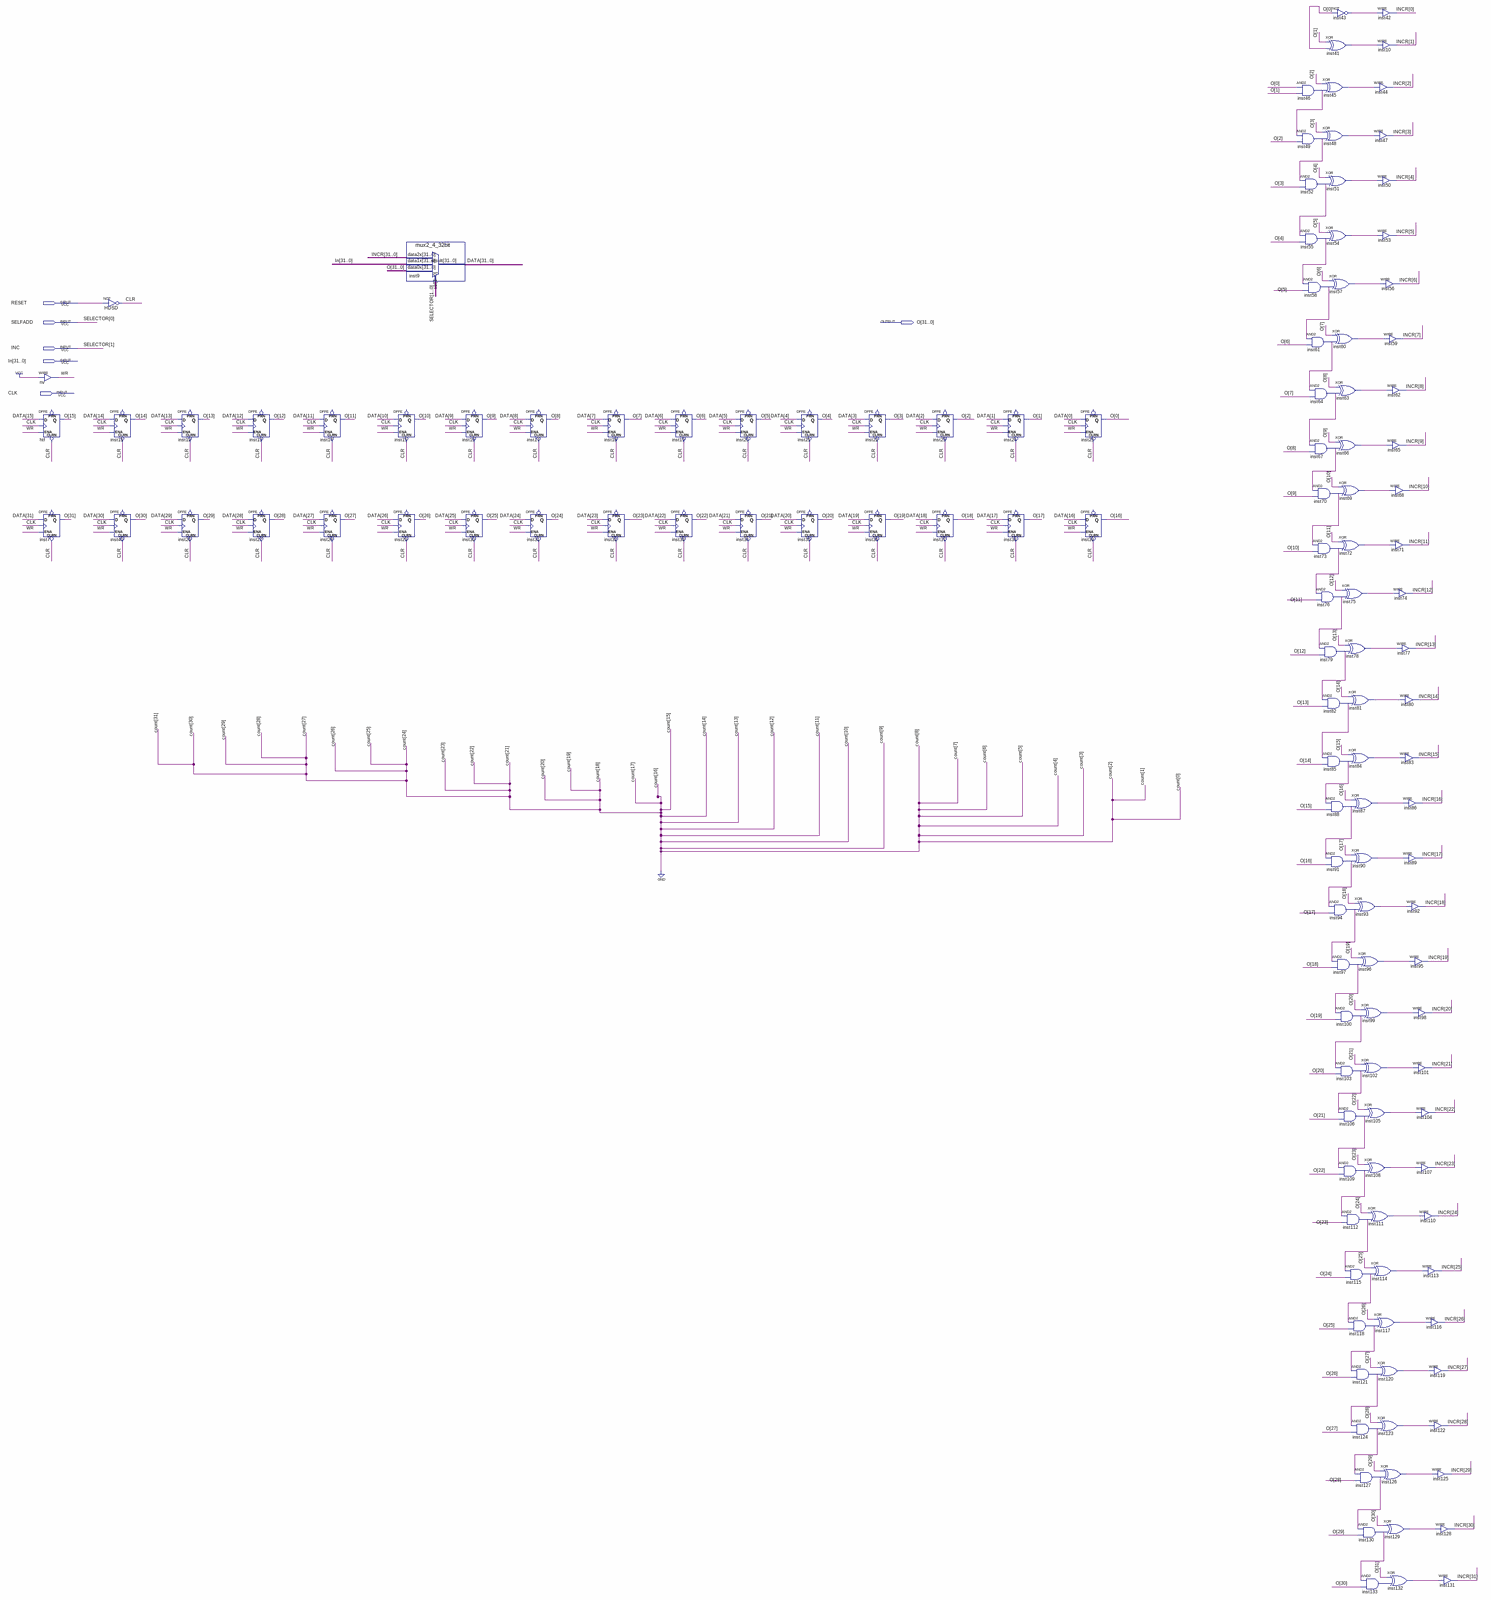
[diagram p0: schematic sheet, whole]
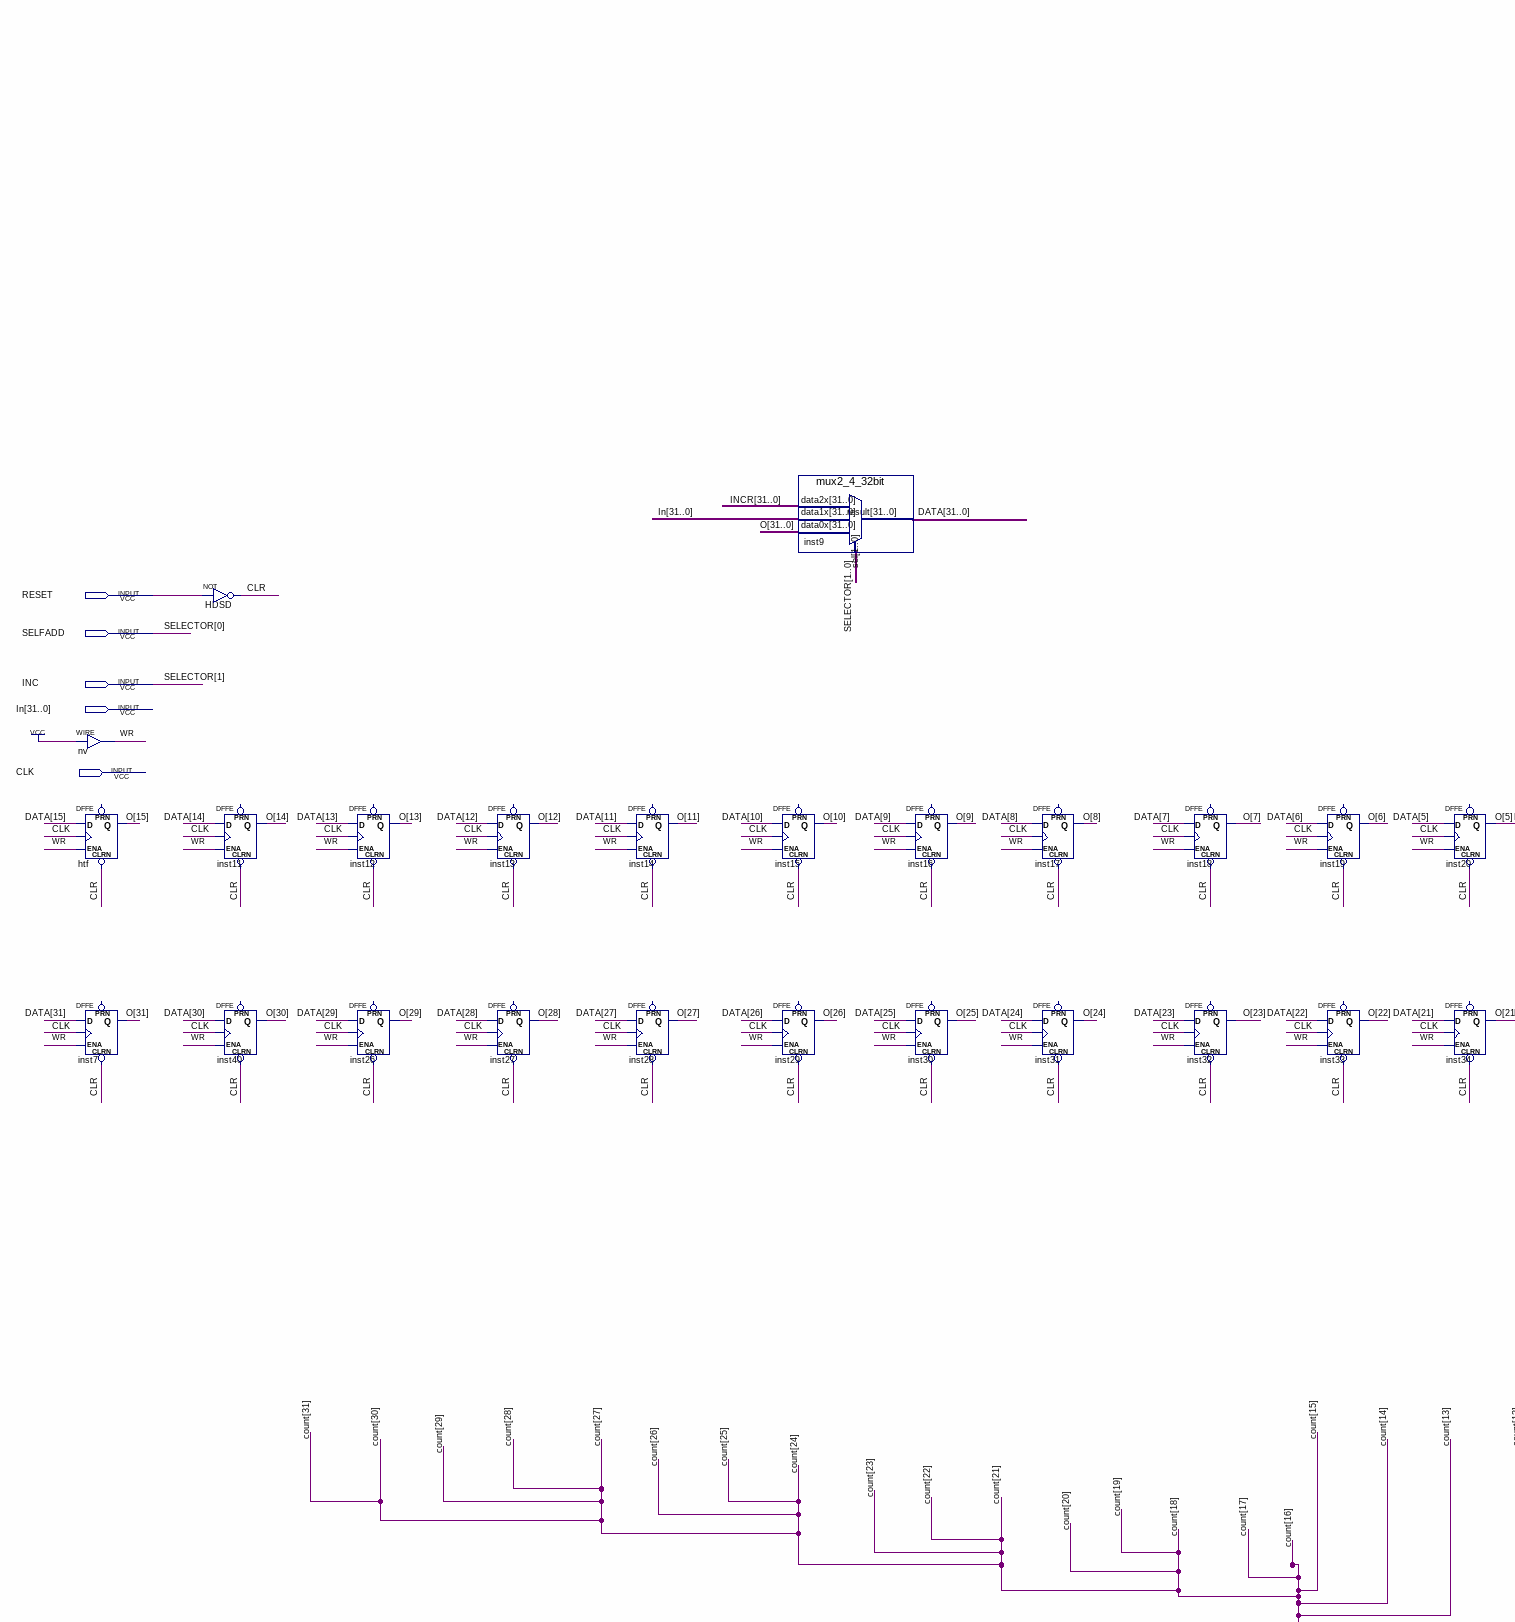
[diagram p1: schematic sheet, upper left part]
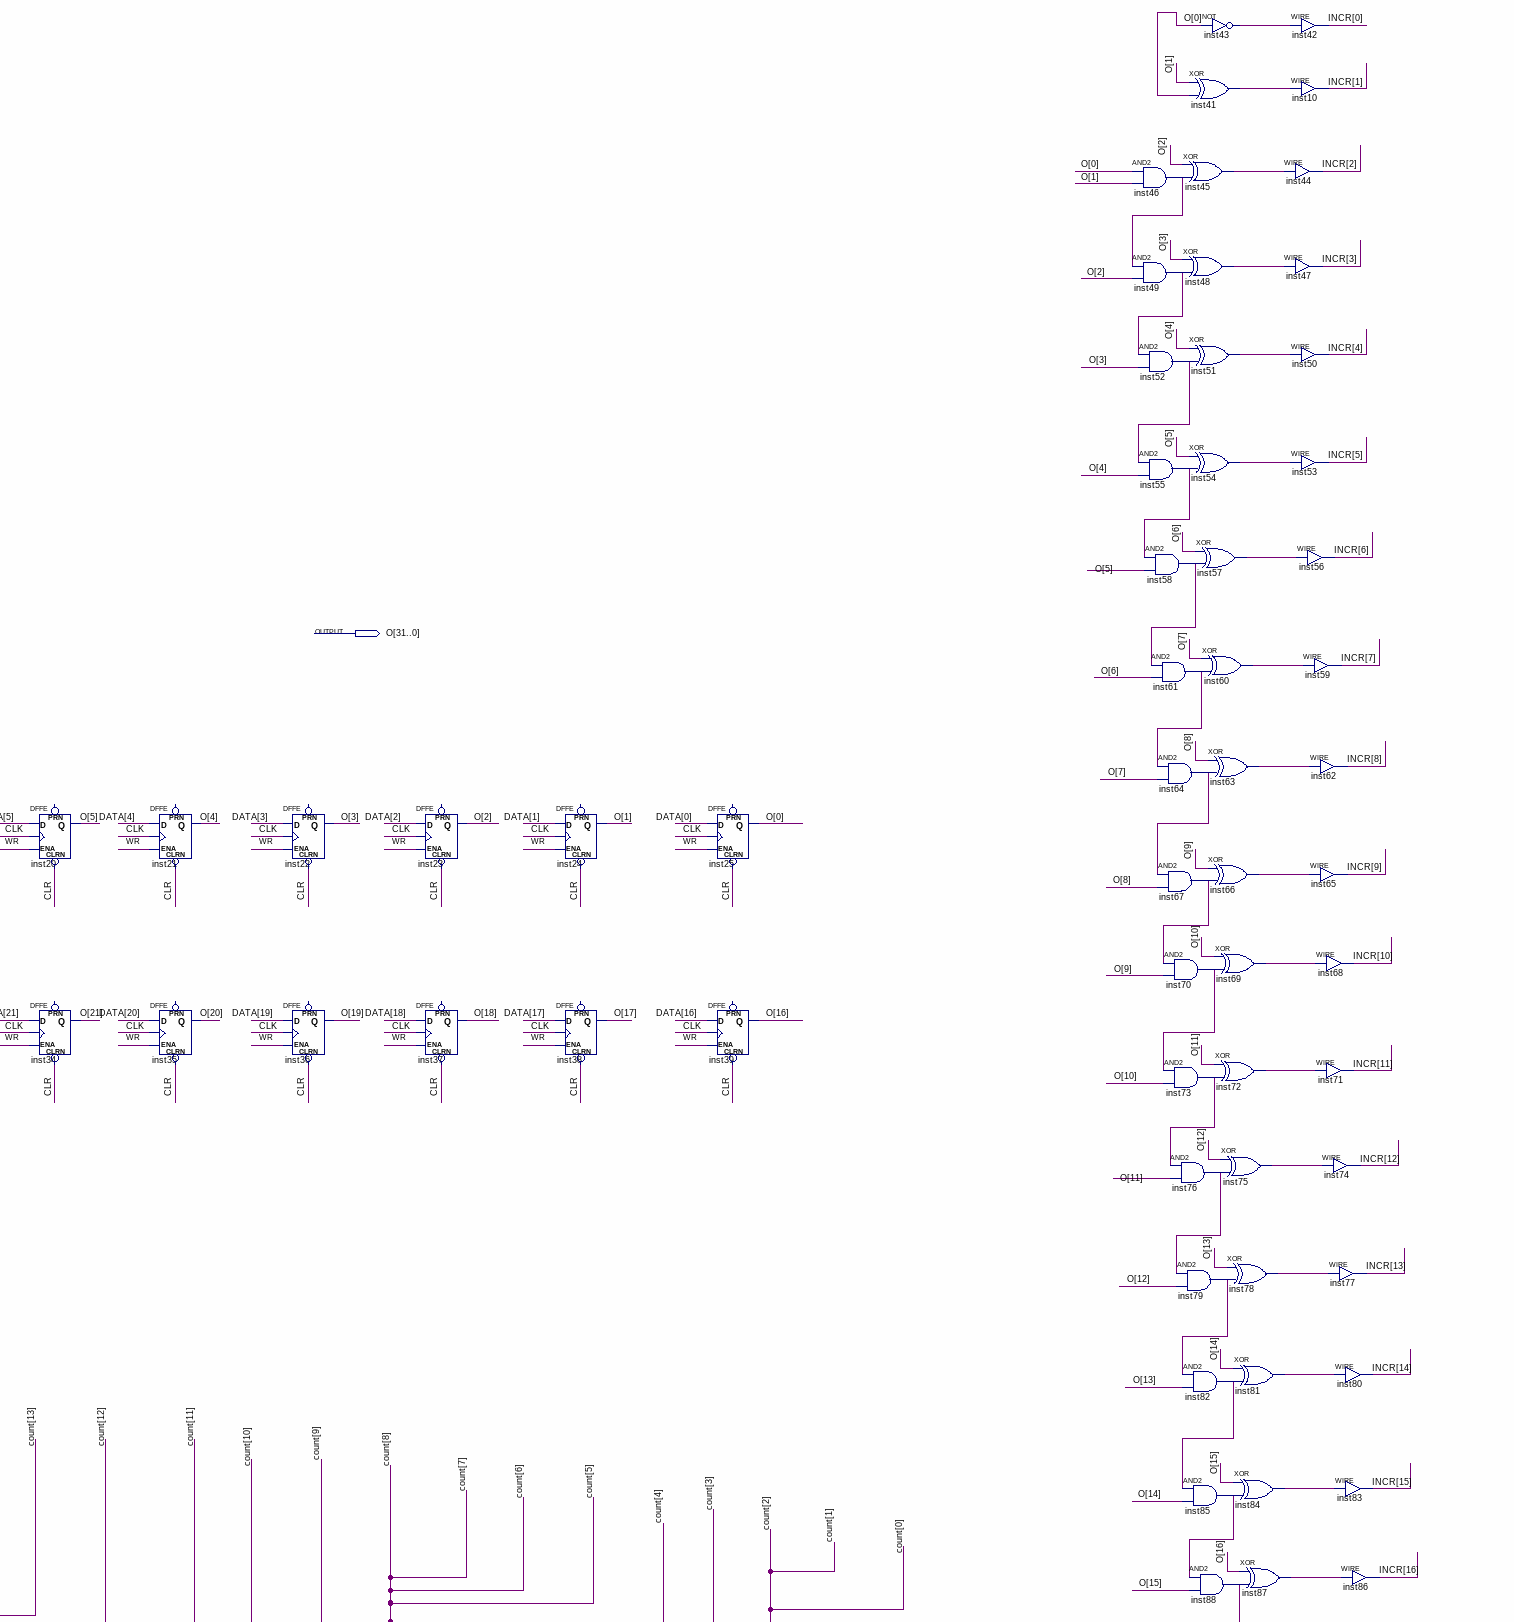
[diagram p2: schematic sheet, upper right part]
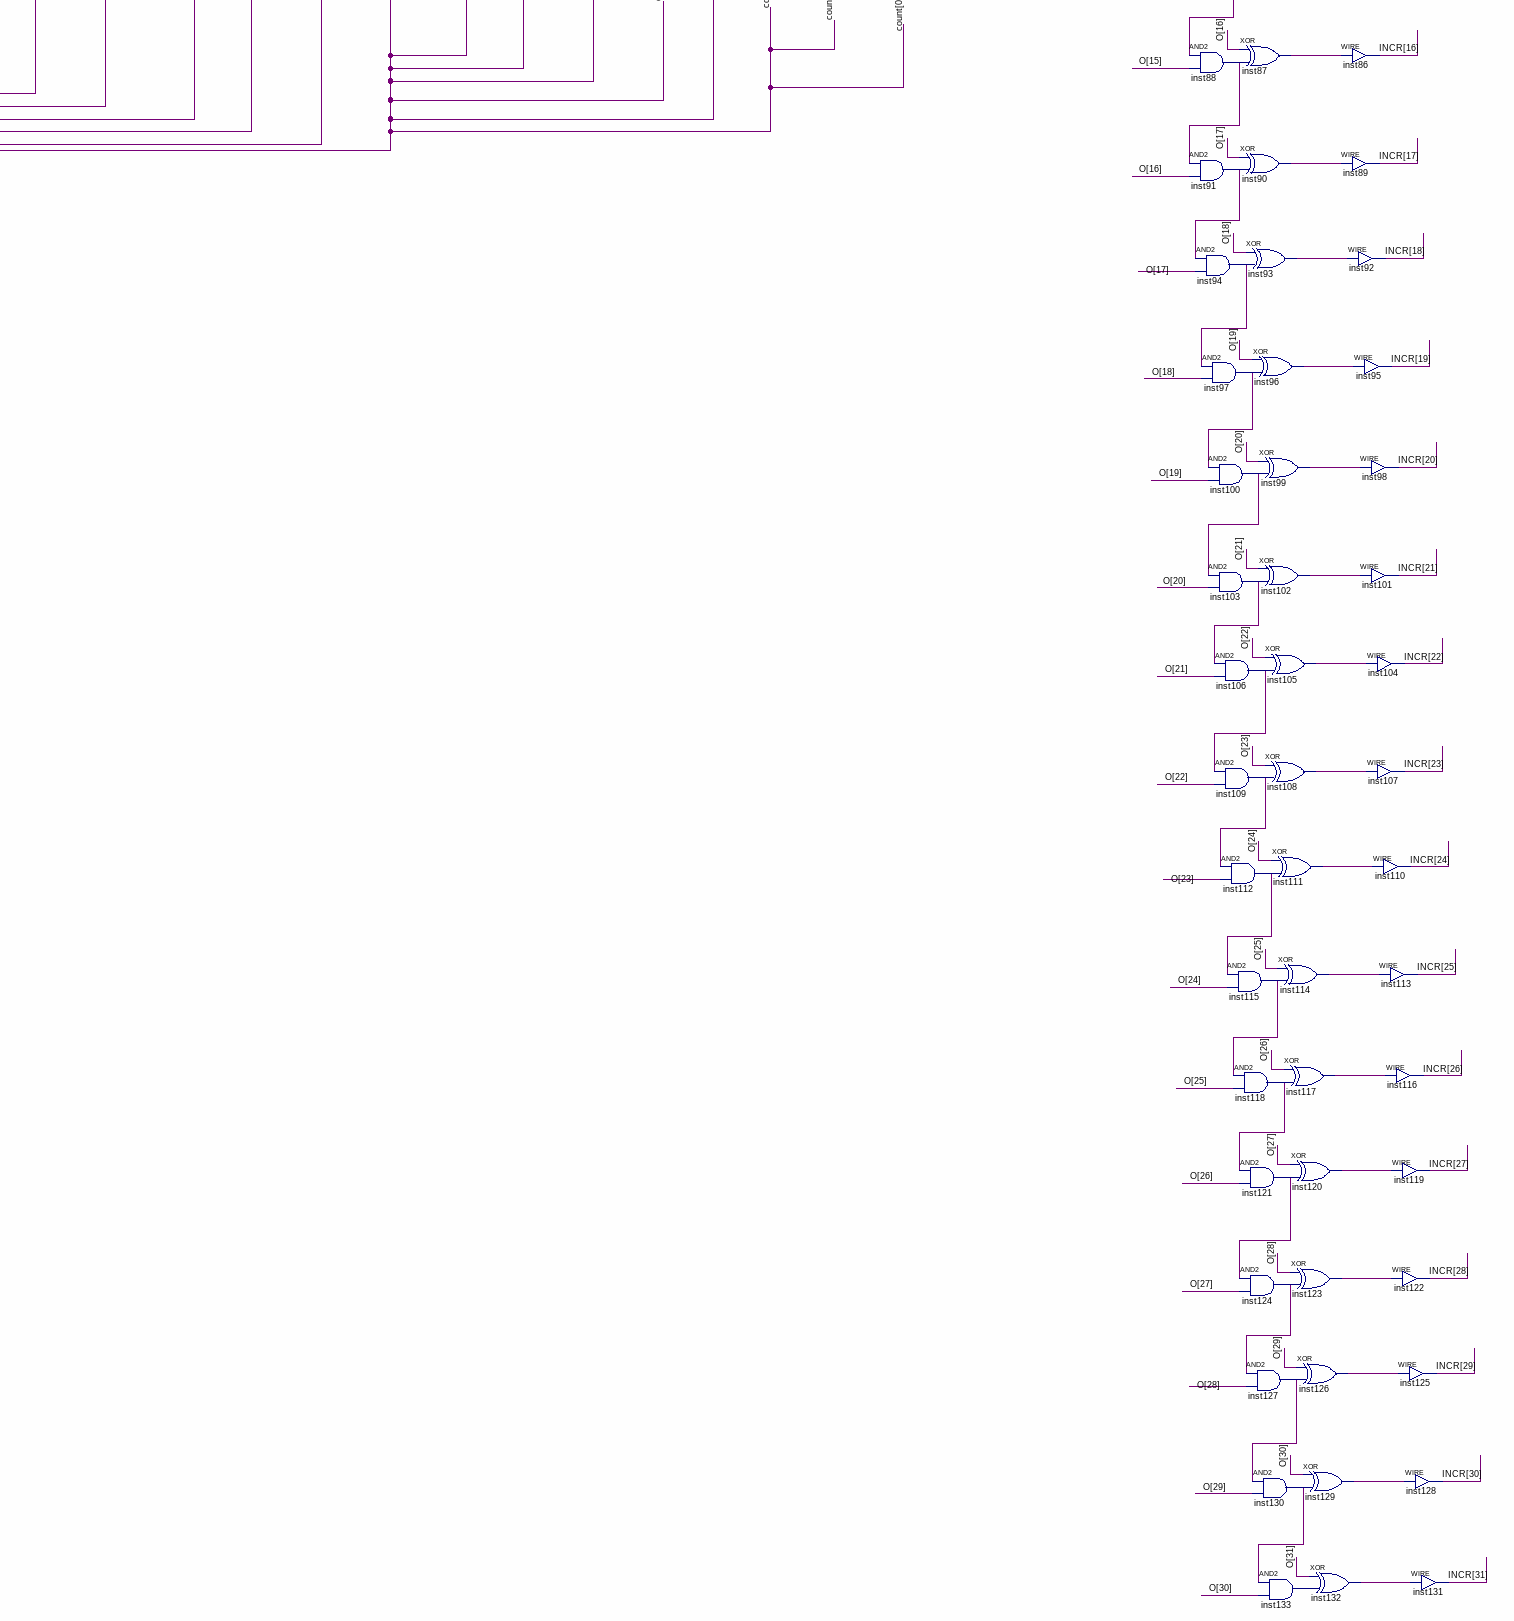
[diagram p3: schematic sheet, lower right part]
// Quartus schematic PCwithoutCLR.bdf as structural Verilog: 129 symbols, 6 pins
module PCwithoutCLR (
  input  RESET,
  input  SELFADD,
  input  INC,
  input  [31:0] In,
  input  CLK,
  output [31:0] O
);

  wire CLR, inst41_out, inst43_out, inst45_out, inst46_out, inst48_out, inst49_out, inst51_out, inst52_out,
       inst54_out, inst55_out, inst57_out, inst58_out, inst60_out, inst61_out, inst63_out, inst64_out,
       inst66_out, inst67_out, inst69_out, inst70_out, inst72_out, inst73_out, inst75_out, inst76_out,
       inst78_out, inst79_out, inst81_out, inst82_out, inst84_out, inst85_out, inst87_out, inst88_out,
       inst90_out, inst91_out, inst93_out, inst94_out, inst96_out, inst97_out, inst99_out, inst100_out,
       inst102_out, inst103_out, inst105_out, inst106_out, inst108_out, inst109_out, inst111_out,
       inst112_out, inst114_out, inst115_out, inst117_out, inst118_out, inst120_out, inst121_out,
       inst123_out, inst124_out, inst126_out, inst127_out, inst129_out, inst130_out, inst132_out,
       inst133_out, WR;
  wire [31:0] DATA, INCR;

  assign WR = 1'b1;  // WIRE nv
  DFFE htf (.CLRN(CLR), .D(DATA[15]), .CLK(CLK), .ENA(WR), .Q(O[15]));  // open: PRN
  DFFE inst7 (.CLRN(CLR), .D(DATA[31]), .CLK(CLK), .ENA(WR), .Q(O[31]));  // open: PRN
  not HDSD (CLR, RESET);
  DFFE inst11 (.CLRN(CLR), .D(DATA[14]), .CLK(CLK), .ENA(WR), .Q(O[14]));  // open: PRN
  DFFE inst40 (.CLRN(CLR), .D(DATA[30]), .CLK(CLK), .ENA(WR), .Q(O[30]));  // open: PRN
  DFFE inst12 (.CLRN(CLR), .D(DATA[13]), .CLK(CLK), .ENA(WR), .Q(O[13]));  // open: PRN
  DFFE inst26 (.CLRN(CLR), .D(DATA[29]), .CLK(CLK), .ENA(WR), .Q(O[29]));  // open: PRN
  DFFE inst13 (.CLRN(CLR), .D(DATA[12]), .CLK(CLK), .ENA(WR), .Q(O[12]));  // open: PRN
  DFFE inst27 (.CLRN(CLR), .D(DATA[28]), .CLK(CLK), .ENA(WR), .Q(O[28]));  // open: PRN
  DFFE inst14 (.CLRN(CLR), .D(DATA[11]), .CLK(CLK), .ENA(WR), .Q(O[11]));  // open: PRN
  DFFE inst28 (.CLRN(CLR), .D(DATA[27]), .CLK(CLK), .ENA(WR), .Q(O[27]));  // open: PRN
  mux2_4_32bit inst9 (.data2x(INCR), .data1x(In), .data0x(O), .sel({INC, SELFADD}), .result(DATA));
  DFFE inst15 (.CLRN(CLR), .D(DATA[10]), .CLK(CLK), .ENA(WR), .Q(O[10]));  // open: PRN
  DFFE inst29 (.CLRN(CLR), .D(DATA[26]), .CLK(CLK), .ENA(WR), .Q(O[26]));  // open: PRN
  DFFE inst16 (.CLRN(CLR), .D(DATA[9]), .CLK(CLK), .ENA(WR), .Q(O[9]));  // open: PRN
  DFFE inst30 (.CLRN(CLR), .D(DATA[25]), .CLK(CLK), .ENA(WR), .Q(O[25]));  // open: PRN
  DFFE inst17 (.CLRN(CLR), .D(DATA[8]), .CLK(CLK), .ENA(WR), .Q(O[8]));  // open: PRN
  DFFE inst31 (.CLRN(CLR), .D(DATA[24]), .CLK(CLK), .ENA(WR), .Q(O[24]));  // open: PRN
  DFFE inst18 (.CLRN(CLR), .D(DATA[7]), .CLK(CLK), .ENA(WR), .Q(O[7]));  // open: PRN
  DFFE inst32 (.CLRN(CLR), .D(DATA[23]), .CLK(CLK), .ENA(WR), .Q(O[23]));  // open: PRN
  DFFE inst19 (.CLRN(CLR), .D(DATA[6]), .CLK(CLK), .ENA(WR), .Q(O[6]));  // open: PRN
  DFFE inst33 (.CLRN(CLR), .D(DATA[22]), .CLK(CLK), .ENA(WR), .Q(O[22]));  // open: PRN
  DFFE inst20 (.CLRN(CLR), .D(DATA[5]), .CLK(CLK), .ENA(WR), .Q(O[5]));  // open: PRN
  DFFE inst34 (.CLRN(CLR), .D(DATA[21]), .CLK(CLK), .ENA(WR), .Q(O[21]));  // open: PRN
  DFFE inst21 (.CLRN(CLR), .D(DATA[4]), .CLK(CLK), .ENA(WR), .Q(O[4]));  // open: PRN
  DFFE inst35 (.CLRN(CLR), .D(DATA[20]), .CLK(CLK), .ENA(WR), .Q(O[20]));  // open: PRN
  DFFE inst22 (.CLRN(CLR), .D(DATA[3]), .CLK(CLK), .ENA(WR), .Q(O[3]));  // open: PRN
  DFFE inst36 (.CLRN(CLR), .D(DATA[19]), .CLK(CLK), .ENA(WR), .Q(O[19]));  // open: PRN
  DFFE inst23 (.CLRN(CLR), .D(DATA[2]), .CLK(CLK), .ENA(WR), .Q(O[2]));  // open: PRN
  DFFE inst37 (.CLRN(CLR), .D(DATA[18]), .CLK(CLK), .ENA(WR), .Q(O[18]));  // open: PRN
  DFFE inst24 (.CLRN(CLR), .D(DATA[1]), .CLK(CLK), .ENA(WR), .Q(O[1]));  // open: PRN
  DFFE inst38 (.CLRN(CLR), .D(DATA[17]), .CLK(CLK), .ENA(WR), .Q(O[17]));  // open: PRN
  DFFE inst25 (.CLRN(CLR), .D(DATA[0]), .CLK(CLK), .ENA(WR), .Q(O[0]));  // open: PRN
  DFFE inst39 (.CLRN(CLR), .D(DATA[16]), .CLK(CLK), .ENA(WR), .Q(O[16]));  // open: PRN
  and inst46 (inst46_out, O[0], O[1]);
  and inst49 (inst49_out, inst46_out, O[2]);
  and inst52 (inst52_out, inst49_out, O[3]);
  and inst55 (inst55_out, inst52_out, O[4]);
  and inst58 (inst58_out, inst55_out, O[5]);
  and inst61 (inst61_out, inst58_out, O[6]);
  and inst64 (inst64_out, inst61_out, O[7]);
  and inst67 (inst67_out, inst64_out, O[8]);
  not inst43 (inst43_out, O[0]);
  xor inst41 (inst41_out, O[1], O[0]);
  xor inst45 (inst45_out, O[2], inst46_out);
  xor inst48 (inst48_out, O[3], inst49_out);
  xor inst51 (inst51_out, O[4], inst52_out);
  xor inst54 (inst54_out, O[5], inst55_out);
  xor inst57 (inst57_out, O[6], inst58_out);
  xor inst60 (inst60_out, O[7], inst61_out);
  xor inst63 (inst63_out, O[8], inst64_out);
  xor inst66 (inst66_out, O[9], inst67_out);
  and inst70 (inst70_out, inst67_out, O[9]);
  and inst73 (inst73_out, inst70_out, O[10]);
  and inst76 (inst76_out, inst73_out, O[11]);
  and inst79 (inst79_out, inst76_out, O[12]);
  and inst82 (inst82_out, inst79_out, O[13]);
  and inst85 (inst85_out, inst82_out, O[14]);
  and inst88 (inst88_out, inst85_out, O[15]);
  and inst91 (inst91_out, inst88_out, O[16]);
  and inst94 (inst94_out, inst91_out, O[17]);
  and inst97 (inst97_out, inst94_out, O[18]);
  and inst100 (inst100_out, inst97_out, O[19]);
  and inst103 (inst103_out, inst100_out, O[20]);
  xor inst69 (inst69_out, O[10], inst70_out);
  xor inst72 (inst72_out, O[11], inst73_out);
  xor inst75 (inst75_out, O[12], inst76_out);
  xor inst78 (inst78_out, O[13], inst79_out);
  xor inst81 (inst81_out, O[14], inst82_out);
  xor inst84 (inst84_out, O[15], inst85_out);
  xor inst87 (inst87_out, O[16], inst88_out);
  xor inst90 (inst90_out, O[17], inst91_out);
  xor inst93 (inst93_out, O[18], inst94_out);
  xor inst96 (inst96_out, O[19], inst97_out);
  xor inst99 (inst99_out, O[20], inst100_out);
  xor inst102 (inst102_out, O[21], inst103_out);
  and inst106 (inst106_out, inst103_out, O[21]);
  and inst109 (inst109_out, inst106_out, O[22]);
  and inst112 (inst112_out, inst109_out, O[23]);
  and inst115 (inst115_out, inst112_out, O[24]);
  and inst118 (inst118_out, inst115_out, O[25]);
  and inst121 (inst121_out, inst118_out, O[26]);
  and inst124 (inst124_out, inst121_out, O[27]);
  and inst127 (inst127_out, inst124_out, O[28]);
  and inst130 (inst130_out, inst127_out, O[29]);
  and inst133 (inst133_out, inst130_out, O[30]);
  assign INCR[0] = inst43_out;  // WIRE inst42
  assign INCR[1] = inst41_out;  // WIRE inst10
  assign INCR[2] = inst45_out;  // WIRE inst44
  assign INCR[3] = inst48_out;  // WIRE inst47
  assign INCR[4] = inst51_out;  // WIRE inst50
  assign INCR[5] = inst54_out;  // WIRE inst53
  assign INCR[6] = inst57_out;  // WIRE inst56
  assign INCR[7] = inst60_out;  // WIRE inst59
  assign INCR[8] = inst63_out;  // WIRE inst62
  assign INCR[9] = inst66_out;  // WIRE inst65
  xor inst105 (inst105_out, O[22], inst106_out);
  xor inst108 (inst108_out, O[23], inst109_out);
  xor inst111 (inst111_out, O[24], inst112_out);
  xor inst114 (inst114_out, O[25], inst115_out);
  xor inst117 (inst117_out, O[26], inst118_out);
  xor inst120 (inst120_out, O[27], inst121_out);
  xor inst123 (inst123_out, O[28], inst124_out);
  xor inst126 (inst126_out, O[29], inst127_out);
  xor inst129 (inst129_out, O[30], inst130_out);
  xor inst132 (inst132_out, O[31], inst133_out);
  assign INCR[10] = inst69_out;  // WIRE inst68
  assign INCR[11] = inst72_out;  // WIRE inst71
  assign INCR[12] = inst75_out;  // WIRE inst74
  assign INCR[13] = inst78_out;  // WIRE inst77
  assign INCR[14] = inst81_out;  // WIRE inst80
  assign INCR[15] = inst84_out;  // WIRE inst83
  assign INCR[16] = inst87_out;  // WIRE inst86
  assign INCR[17] = inst90_out;  // WIRE inst89
  assign INCR[18] = inst93_out;  // WIRE inst92
  assign INCR[19] = inst96_out;  // WIRE inst95
  assign INCR[20] = inst99_out;  // WIRE inst98
  assign INCR[21] = inst102_out;  // WIRE inst101
  assign INCR[22] = inst105_out;  // WIRE inst104
  assign INCR[23] = inst108_out;  // WIRE inst107
  assign INCR[24] = inst111_out;  // WIRE inst110
  assign INCR[25] = inst114_out;  // WIRE inst113
  assign INCR[26] = inst117_out;  // WIRE inst116
  assign INCR[27] = inst120_out;  // WIRE inst119
  assign INCR[28] = inst123_out;  // WIRE inst122
  assign INCR[29] = inst126_out;  // WIRE inst125
  assign INCR[30] = inst129_out;  // WIRE inst128
  assign INCR[31] = inst132_out;  // WIRE inst131

  // Other names for the same wires on the sheet: SELECTOR[1:0] = {INC, SELFADD}
endmodule
